# EAGLE design videoselector_2.1v (EAGLE 7.3.0)
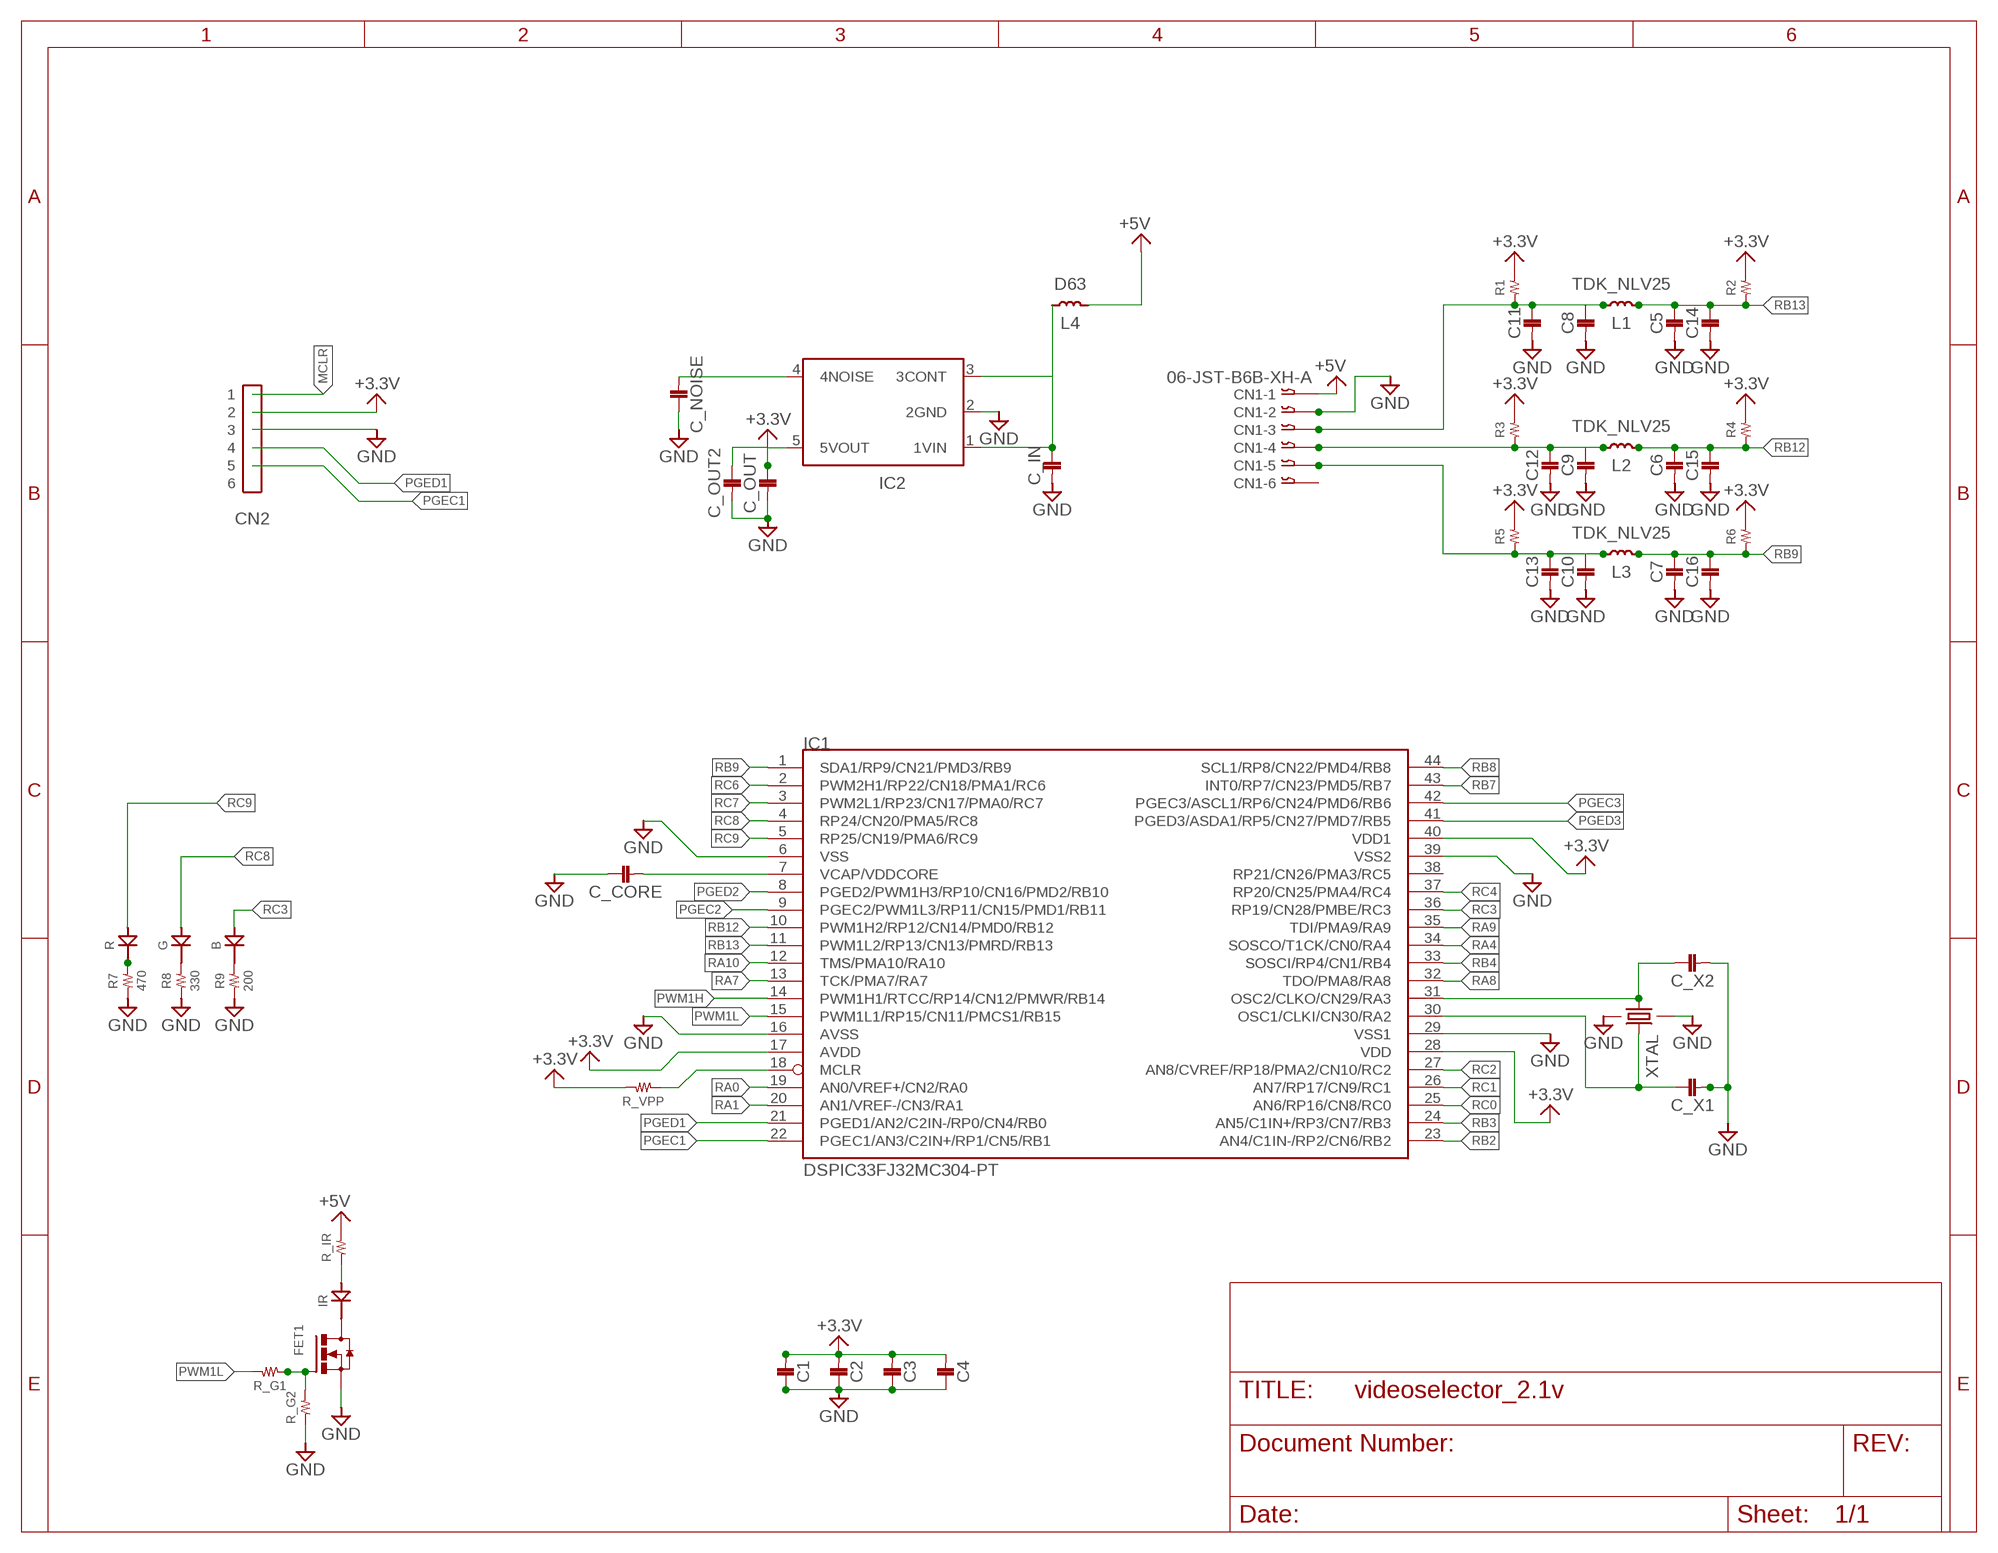
[diagram p0: schematic, sheet 1]

## Parts
B  CHIPLED  [1608]
C1  1608  [1608]
C2  1608  [1608]
C3  1608  [1608]
C4  1608  [1608]
C5  1608  [1608]
C6  1608  [1608]
C7  1608  [1608]
C8  1608  [1608]
C9  1608  [1608]
C10  1608  [1608]
C11  3225  [3225]
C12  3225  [3225]
C13  3225  [3225]
C14  3225  [3225]
C15  3225  [3225]
C16  3225  [3225]
C_CORE  2012  [2012]
C_IN  1608  [1608]
C_NOISE  1608  [1608]
C_OUT  1608  [1608]
C_OUT2  2012  [2012]
C_X1  1608  [1608]
C_X2  1608  [1608]
CN1  06-JST-B6B-XH-A  [B6B-XH]
CN2  PIN_HEADER_6  [PIN_HEADER_6]
FET1  ＩＲＬＭＬ６３４４  [SOT23]
G  CHIPLED  [1608]
IC1  DSPIC33FJ32MC304-PT  [TQFP44]
IC2  TAR5SB  [SSOP5-P-0.95]
IR  5MMLED  [5MM]
L1  TDK_NLV25  [TDK_NLV]
L2  TDK_NLV25  [TDK_NLV]
L3  TDK_NLV25  [TDK_NLV]
L4  D63  [TOKO]
R  CHIPLED  [1608]
R1  RESISTOR__SMD  [1608]
R2  RESISTOR__SMD  [1608]
R3  RESISTOR__SMD  [1608]
R4  RESISTOR__SMD  [1608]
R5  RESISTOR__SMD  [1608]
R6  RESISTOR__SMD  [1608]
R7  470  RESISTOR__SMD  [1608]
R8  330  RESISTOR__SMD  [1608]
R9  200  RESISTOR__SMD  [1608]
R_G1  RESISTOR__SMD  [1608]
R_G2  RESISTOR__SMD  [1608]
R_IR  RESISTOR__SMD  [1608]
R_VPP  RESISTOR__SMD  [1608]
XTAL  FA-238  [FA-238]

## Nets
+3.3V [3.3V]: C1.P$2 C2.P$2 C3.P$2 C4.P$2 C_OUT2.1 C_OUT.P$1 CN2.2 IC1.17(AVDD) IC1.28(VDD) IC1.40(VDD1) IC2.5(5VOUT) R1.2 R2.2 R3.2 R4.2 R5.2 R6.2 R_VPP.2
+5V: CN1.P$1 L4.2 R_IR.2
GND: C1.P$1 C2.P$1 C3.P$1 C4.P$1 C5.P$2 C6.P$2 C7.P$2 C8.P$2 C9.P$2 C10.P$2 C11.P$2 C12.P$2 C13.P$2 C14.P$2 C15.P$2 C16.P$2 C_CORE.1 C_IN.P$2 C_NOISE.P$1 C_OUT2.2 C_OUT.P$2 C_X1.P$2 C_X2.P$2 CN1.P$2 CN2.3 FET1.2(S) IC1.6(VSS) IC1.16(AVSS) IC1.29(VSS1) IC1.39(VSS2) IC2.2(2GND) R7.1 R8.1 R9.1 R_G2.1 XTAL.2 XTAL.4
IC2: C_NOISE.P$2 IC2.4(4NOISE)
MCLR: CN2.1 IC1.18(MCLR) R_VPP.1
N$1: FET1.3(D) IR.K
N$2: R7.2 R.2(K)
N$3: G.2(K) R8.2
N$4: B.2(K) R9.2
N$5: IR.A R_IR.1
N$7: C8.P$1 C11.P$1 CN1.P$3 L1.P$1 R1.1
N$8: C9.P$1 C12.P$1 CN1.P$4 L2.P$1 R3.1
N$9: C_X2.P$1 IC1.31(OSC2/CLKO/CN29/RA3) XTAL.1
N$10: FET1.1(G) R_G1.1 R_G2.2
N$11: C_X1.P$1 IC1.30(OSC1/CLKI/CN30/RA2) XTAL.3
N$13: C10.P$1 C13.P$1 CN1.P$5 L3.P$1 R5.1
N$16: C_IN.P$1 IC2.1(1VIN) IC2.3(3CONT) L4.1
PGEC1: CN2.5 IC1.22(PGEC1/AN3/C2IN+/RP1/CN5/RB1)
PGEC2: IC1.9(PGEC2/PWM1L3/RP11/CN15/PMD1/RB11)
PGEC3: IC1.42(PGEC3/ASCL1/RP6/CN24/PMD6/RB6)
PGED1: CN2.4 IC1.21(PGED1/AN2/C2IN-/RP0/CN4/RB0)
PGED2: IC1.8(PGED2/PWM1H3/RP10/CN16/PMD2/RB10)
PGED3: IC1.41(PGED3/ASDA1/RP5/CN27/PMD7/RB5)
PWM1H: IC1.14(PWM1H1/RTCC/RP14/CN12/PMWR/RB14)
PWM1L: IC1.15(PWM1L1/RP15/CN11/PMCS1/RB15) R_G1.2
RA0: IC1.19(AN0/VREF+/CN2/RA0)
RA1: IC1.20(AN1/VREF-/CN3/RA1)
RA4: IC1.34(SOSCO/T1CK/CN0/RA4)
RA7: IC1.13(TCK/PMA7/RA7)
RA8: IC1.32(TDO/PMA8/RA8)
RA9: IC1.35(TDI/PMA9/RA9)
RA10: IC1.12(TMS/PMA10/RA10)
RB2: IC1.23(AN4/C1IN-/RP2/CN6/RB2)
RB3: IC1.24(AN5/C1IN+/RP3/CN7/RB3)
RB4: IC1.33(SOSCI/RP4/CN1/RB4)
RB7: IC1.43(INT0/RP7/CN23/PMD5/RB7)
RB8: IC1.44(SCL1/RP8/CN22/PMD4/RB8)
RB9: C7.P$1 C16.P$1 IC1.1(SDA1/RP9/CN21/PMD3/RB9) L3.P$2 R6.1
RB12: C6.P$1 C15.P$1 IC1.10(PWM1H2/RP12/CN14/PMD0/RB12) L2.P$2 R4.1
RB13: C5.P$1 C14.P$1 IC1.11(PWM1L2/RP13/CN13/PMRD/RB13) L1.P$2 R2.1
RC0: IC1.25(AN6/RP16/CN8/RC0)
RC1: IC1.26(AN7/RP17/CN9/RC1)
RC2: IC1.27(AN8/CVREF/RP18/PMA2/CN10/RC2)
RC3: B.1(A) IC1.36(RP19/CN28/PMBE/RC3)
RC4: IC1.37(RP20/CN25/PMA4/RC4)
RC6: IC1.2(PWM2H1/RP22/CN18/PMA1/RC6)
RC7: IC1.3(PWM2L1/RP23/CN17/PMA0/RC7)
RC8: G.1(A) IC1.4(RP24/CN20/PMA5/RC8)
RC9: IC1.5(RP25/CN19/PMA6/RC9) R.1(A)
VCAP/VDDCORE: C_CORE.2 IC1.7(VCAP/VDDCORE)
Unconnected: CN1.P$6 CN2.6 IC1.38(RP21/CN26/PMA3/RC5)

## Library data of the parts
B G R = 10_LED:CHIPLED
C1-C10 C_IN C_NOISE C_OUT C_X1 C_X2 = 02_C:1608
C11-C16 = 02_C:3225
C_CORE C_OUT2 = 02_C:2012
CN1 = con-jst-xh:06-JST: JST CONNECTOR
CN2 = 08_CONECTOR:PIN_HEADER_6
FET1 = 06_FET:ＩＲＬＭＬ６３４４
IC1 = microchip-dspic33fjxxmc (1):DSPIC33FJ32MC304: dsPIC33FJ32MC302/304, dsPIC33FJ64MCX02/X04, AND dsPIC33FJ128MCX02/X04 High-Performance, 16-bit Digital Signal Controllers Operating Range: * Up to 40 MIPS operation (at 3.0V -3.6V): - Industrial temperature range (-40°C to +85°C) - Extended temperature range (-40°C to +125°C) High-Performance DSC CPU: * Modified Harvard architecture * C compiler optimized instruction set * 16-bit wide data path * 24-bit wide instructions * Linear program memory addressing up to 4M instruction words * Linear data memory addressing up to 64 Kbytes * 83 base instructions: mostly 1 word/1 cycle * Two 40-bit accumulators with rounding and saturation options * Flexible and powerful addressing modes: - Indirect - Modulo - Bit-Reversed * Software stack * 16 x 16 fractional/integer multiply operations * 32/16 and 16/16 divide operations * Single-cycle multiply and accumulate: - Accumulator write back for DSP operations - Dual data fetch * Up to ±16-bit shifts for up to 40-bit data Direct Memory Access (DMA): * 8-channel hardware DMA * Up to 2 Kbytes dual ported DMA buffer area (DMA RAM) to store data transferred via DMA: - Allows data transfer between RAM and a peripheral while CPU is executing code (no cycle stealing) * Most peripherals support DMA Timers/Capture/Compare/PWM: * Timer/Counters, up to five 16-bit timers: - Can pair up to make two 32-bit timers - One timer runs as a Real-Time Clock with an external 32.768 kHz oscillator - Programmable prescaler * Input Capture (up to four channels): - Capture on up, down or both edges - 16-bit capture input functions - 4-deep FIFO on each capture * Output Compare (up to four channels): - Single or Dual 16-bit Compare mode - 16-bit Glitchless PWM mode * Hardware Real-Time Clock/Calendar (RTCC): - Provides clock, calendar, and alarm functions Interrupt Controller: * 5-cycle latency * Up to 53 available interrupt sources * Up to three external interrupts * Seven programmable priority levels * Five processor exceptions Digital I/O: * Peripheral pin Select functionality * Up to 35 programmable digital I/O pins * Wake-up/Interrupt-on-Change for up to 31 pins * Output pins can drive from 3.0V to 3.6V * Up to 5V output with open drain configuration * All digital input pins are 5V tolerant * 4 mA sink on all I/O pins On-Chip Flash and SRAM: * Flash program memory (up to 128 Kbytes) * Data SRAM (up to 16 Kbytes) * Boot, Secure, and General Security for program Flash System Management: * Flexible clock options: - External, crystal, resonator, internal RC - Fully integrated Phase-Locked Loop (PLL) - Extremely low jitter PLL * Power-up Timer * Oscillator Start-up Timer/Stabilizer * Watchdog Timer with its own RC oscillator * Fail-Safe Clock Monitor * Reset by multiple sources Power Management: * On-chip 2.5V voltage regulator * Switch between clock sources in real time * Idle, Sleep, and Doze modes with fast wake-up Analog-to-Digital Converters (ADCs): * 10-bit, 1.1 Msps or 12-bit, 500 Ksps conversion: - Two and four simultaneous samples (10-bit ADC) - Up to nine input channels with auto-scanning - Conversion start can be manual or synchronized with one of four trigger sources - Conversion possible in Sleep mode - ±2 LSb max integral nonlinearity - ±1 LSb max differential nonlinearity Audio Digital-to-Analog Converter (DAC): - 16-bit Dual Channel DAC module - 100 Ksps maximum sampling rate - Second-Order Digital Delta-Sigma Modulator Comparator Module: * Two analog comparators with programmable input/output configuration CMOS Flash Technology: * Low-power, high-speed Flash technology * Fully static design * 3.3V (±10%) operating voltage * Industrial and Extended temperature * Low power consumption Motor Control Peripherals: * 6-channel 16-bit Motor Control PWM: - Three duty cycle generators - Independent or Complementary mode - Programmable dead-time and output polarity - Edge-aligned or center-aligned - Manual output override control - One Fault input - Trigger for ADC conversions - PWM frequency for 16-bit resolution (@ 40 MIPS) = 1220 Hz for Edge-Aligned mode, 610 Hz for Center-Aligned mode - PWM frequency for 11-bit resolution (@ 40 MIPS) = 39.1 kHz for Edge-Aligned mode, 19.55 kHz for Center-Aligned mode * 2-channel 16-bit Motor Control PWM: - One duty cycle generator - Independent or Complementary mode - Programmable dead time and output polarity - Edge-aligned or center-aligned - Manual output override control - One Fault input - Trigger for ADC conversions - PWM frequency for 16-bit resolution (@ 40 MIPS) = 1220 Hz for Edge-Aligned mode, 610 Hz for Center-Aligned mode - PWM frequency for 11-bit resolution (@ 40 MIPS) = 39.1 kHz for Edge-Aligned mode, 19.55 kHz for Center-Aligned mode * 2-Quadrature Encoder Interface module: - Phase A, Phase B, and index pulse input - 16-bit up/down position counter - Count direction status - Position Measurement (x2 and x4) mode - Programmable digital noise filters on inputs - Alternate 16-bit Timer/Counter mode - Interrupt on position counter rollover/underflow
IC2 = 04_IC:TAR5SB
IR = 10_LED:5MMLED
L1-L3 = 03_L:TDK_NLV25
L4 = 03_L:D63
R1-R9 R_G1 R_G2 R_IR R_VPP = 01_R:RESISTOR__SMD
XTAL = 09_2_CRYSTAL:FA-238

## Net classes
1 3.3V: clearance 0.25 mm

## Board
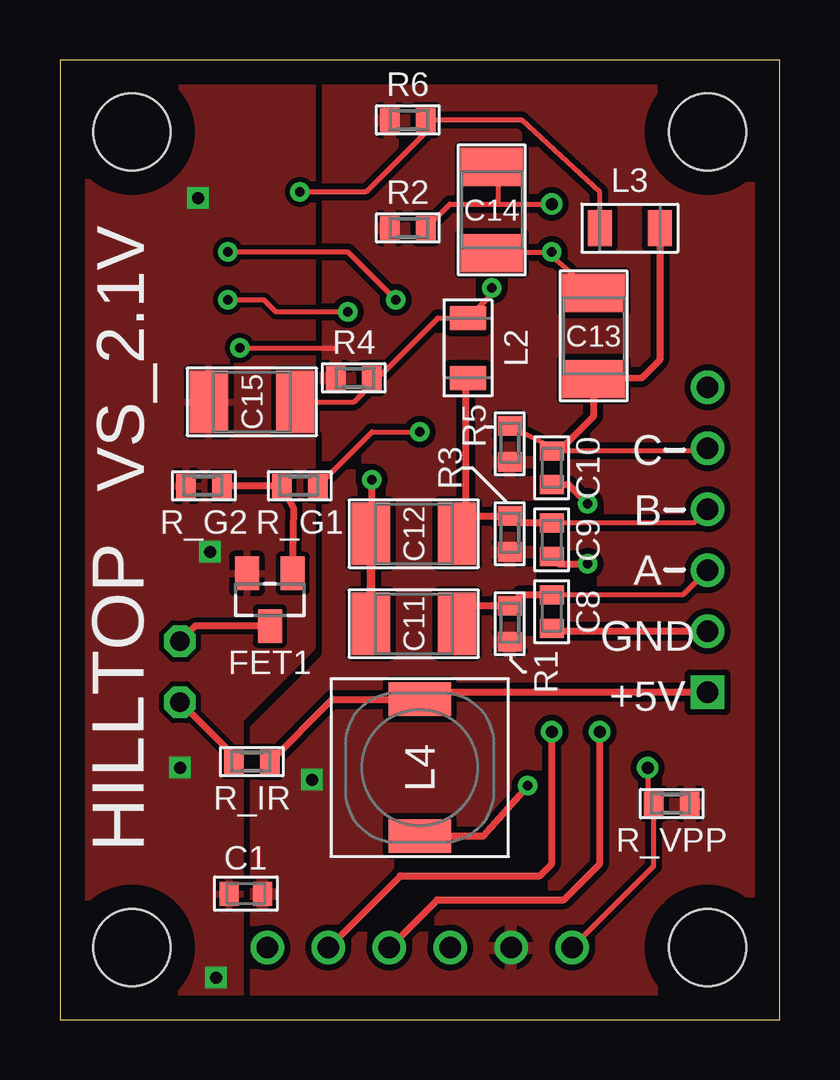
[diagram p1: board, top side]
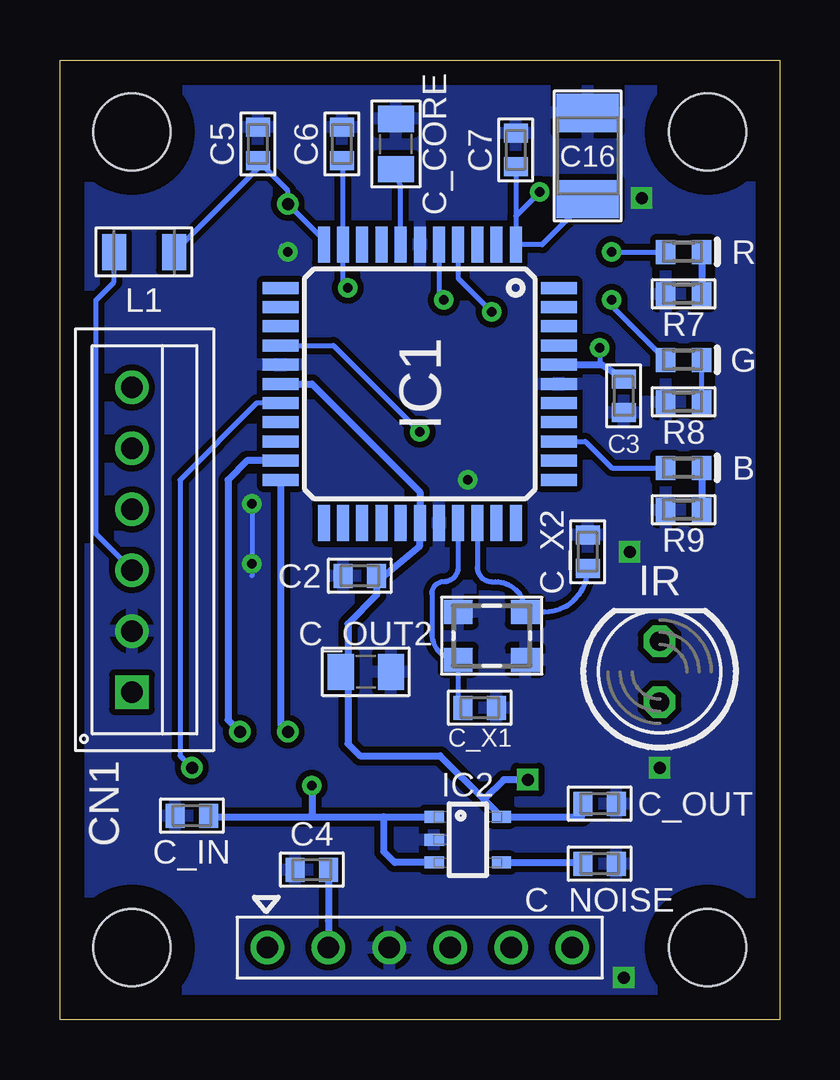
[diagram p2: board, bottom side, seen from below]

Size 30 x 40 mm. Coordinates in mm from the lower left corner, seen from the top.
Outline: 0,0 30,0 30,40 0,40 0,0
Copper layers (1*16): Top 0.035mm / dielectric 1.5mm / Bottom 0.035mm
Design rules "default *": minimum track width 0.2mm, minimum drill 0.4mm, track to track 8mil, track to pad 8mil, pad to pad 8mil, via to via 8mil, smd to smd 8mil, copper to edge 40mil, drill to drill 8mil, minimum pad ring 10mil, minimum via ring 8mil, stop-mask expansion 4mil, vias tented up to drill 4mm, thermal gap 10mil
Holes 3.2 mm at 3,3 3,37 27,37 27,3

### Footprints (pad centres in the part's own frame; a part is rotated, then mirrored left to right if it is on the bottom)
1608 = smd 0.8 x 1: 1 -0.75,0; 2 0.75,0
1608' = smd 0.8 x 1: P$1 -0.7,0; P$2 0.7,0
3225 = smd 1.6 x 2.6: P$1 -1.8,0; P$2 1.8,0
2012 = smd 1.1 x 1.5: 1 -1.05,0; 2 1.05,0
B6B-XH = drill 0.9 square: P$1 6.35,0 | drill 0.9: P$2 3.81,0; P$3 1.27,0; P$4 -1.27,0; P$5 -3.81,0; P$6 -6.35,0
PIN_HEADER_6 = drill 0.9: 1 -6.35,0; 2 -3.81,0; 3 -1.27,0; 4 1.27,0; 5 3.81,0; 6 6.35,0
SOT23 = smd 1 x 1.4: 1 -0.95,-1.1; 2 0.95,-1.1; 3 0,1.1
TQFP44 = smd 1.5 x 0.5: 1 -5.8,4; 2 -5.8,3.2; 3 -5.8,2.4; 4 -5.8,1.6; 5 -5.8,0.8; 6 -5.8,0; 7 -5.8,-0.8; 8 -5.8,-1.6; 9 -5.8,-2.4; 10 -5.8,-3.2; 11 -5.8,-4; 23 5.8,-4; 24 5.8,-3.2; 25 5.8,-2.4; 26 5.8,-1.6; 27 5.8,-0.8; 28 5.8,0; 29 5.8,0.8; 30 5.8,1.6; 31 5.8,2.4; 32 5.8,3.2; 33 5.8,4 | smd 0.5 x 1.5: 12 -4,-5.8; 13 -3.2,-5.8; 14 -2.4,-5.8; 15 -1.6,-5.8; 16 -0.8,-5.8; 17 0,-5.8; 18 0.8,-5.8; 19 1.6,-5.8; 20 2.4,-5.8; 21 3.2,-5.8; 22 4,-5.8; 34 4,5.8; 35 3.2,5.8; 36 2.4,5.8; 37 1.6,5.8; 38 0.8,5.8; 39 0,5.8; 40 -0.8,5.8; 41 -1.6,5.8; 42 -2.4,5.8; 43 -3.2,5.8; 44 -4,5.8
SSOP5-P-0.95 = smd 0.5 x 0.8: 1 -0.95,-1.4; 2 0,-1.4; 3 0.95,-1.4; 4 0.95,1.4; 5 -0.95,1.4
5MM = drill 0.813 octagon: A 0,-1.27; K 0,1.27
TDK_NLV = smd 1 x 1.5: P$1 1.25,0; P$2 -1.25,0
TOKO = smd 1.4 x 2.6: 1 -2.85,0; 2 2.85,0
FA-238 = smd 1.2 x 1: 1 -1.4,-1; 2 1.4,-1; 3 1.4,1; 4 -1.4,1

### Placement (x,y rotation side)
B  4,23 0 bottom
C1  [1608']  7.75,5.25 0 top
C2  [1608']  17.5,18.5 0 bottom
C3  [1608']  6.5,26 90 bottom
C4  [1608']  19.5,6.25 0 bottom
C5  [1608']  21.75,36.5 90 bottom
C6  [1608']  18.25,36.5 90 bottom
C7  [1608']  11,36.25 90 bottom
C8  [1608']  20.5,17 270 top
C9  [1608']  20.5,20 270 top
C10  [1608']  20.5,23 270 top
C11  14.75,16.5 180 top
C12  14.75,20.25 180 top
C13  22.25,28.5 90 top
C14  18,33.75 270 top
C15  8,25.75 180 top
C16  8,36 90 bottom
C_CORE  16,36.5 270 bottom
C_IN  [1608']  24.5,8.5 180 bottom
C_NOISE  [1608']  7.5,6.5 180 bottom
C_OUT  [1608']  7.5,9 0 bottom
C_OUT2  17.25,14.5 0 bottom
C_X1  [1608']  12.5,13 0 bottom
C_X2  [1608']  8,19.5 90 bottom
CN1  27,20 270 bottom
CN2  15,3 0 bottom
DRILEGEND  [DRILEGEND]  -7.15,-14.96 0 top  (outside the outline)
FET1  8.75,17.5 180 top
G  4,27.5 0 bottom
IC1  15,26.5 270 bottom
IC2  13,7.5 270 bottom
IR  5,14.5 0 bottom
L1  26.5,32 180 bottom
L2  17,28 270 top
L3  23.75,33 0 top
L4  15,10.5 90 top
R  4,32 0 bottom
R1  18.75,16.5 270 top
R2  14.5,33 180 top
R3  18.75,20.25 270 top
R4  12.25,26.75 180 top
R5  18.75,24 270 top
R6  14.5,37.5 180 top
R7  4,30.25 0 bottom
R8  4,25.75 0 bottom
R9  4,21.25 0 bottom
R_G1  10,22.25 0 top
R_G2  6,22.25 0 top
R_IR  8,10.75 0 top
R_VPP  25.5,9 0 top
XTAL  12,16 180 bottom

### Tracks (layer width: path | path; a pad name or v marks a point on that pad's centre or on a via)
+3.3V  (via drill 0.4, 0.5)
  Top 0.2: v7.5,28 11.5,28
  Bottom 0.2: IC1.40 8.2,27.3 | v7.5,28 7.5,27.4 7.4,27.3
  Bottom 0.3: C4.P$2 18.81,4.11 CN2.2 | C_OUT.P$1 8.25,8.45 IC2.5 12.32,9.18 | IC1.40 7.4,27.3 C3.P$2 | 18,14.55 18,16.5 16.8,17.7 C2.P$2 16.5,18.5 15,19.75 IC1.28 15,22 19.5,26.5 IC1.17 | 18,14.55 C_OUT2.1 | 18,14.55 18,11.5 17.5,11 14.15,11 12.32,9.18 | v10.5,10 11.5,10 12.32,9.18
  pour Top (isolate 0.1, rank 3): 0,40 30,40 30,0 0,0
+5V
  Top 0.3: R_IR.2 11.35,13.35 L4.2 16.3,13.65 CN1.P$1
GND  (via drill 0.4, 0.5)
  Top 0.2: 26.89,16.3 CN1.P$2 | C13.P$2 20.5,31.8 v20.5,32 18.05,32 C14.P$2
  Top 0.3: C12.P$2 C11.P$2 13,16.55 v13,22.5 | C8.P$2 20.61,16.19 CN1.P$2 | C9.P$2 20.8,19 v22,19 | C10.P$2 21.2,22.3 v22,21.5
  Bottom 0.2: 22,18.5 v22,19 v22,21.5 | v20.5,32 20.75,32.25
  other vias: 5,10.5 6.25,19.5 6.5,1.75 5.75,34.25
  pour Bottom (isolate 0.254): 0,40 30,40 30,0 0,0
  pour Top (isolate 0.2): 0,40 10.5,40 10.5,15.5 7.5,12.5 7.5,0 0,0
IC2
  Bottom 0.3: IC2.4 8.25,6.55 C_NOISE.P$2
MCLR  (via drill 0.5)
  Top 0.2: CN2.1 24.75,6.4 R_VPP.1 24.5,9.25 v24.5,10.5
  Bottom 0.2: IC1.18 21.8,25.7 25,22.5 25,11 v24.5,10.5
N$1
  Top 0.3: FET1.3 5.63,16.4 IR.K
N$2
  Bottom 0.3: R.2 R7.2
N$3
  Bottom 0.2: R8.2 G.2
N$4
  Bottom 0.3: B.2 R9.2
N$5
  Top 0.3: R_IR.1 7.25,10.98 IR.A
N$7
  Top 0.2: CN1.P$3 25.97,17.7 C8.P$1
  Top 0.3: C8.P$1 19.2,17.7 R1.1 17.3,17.25 C11.P$1
  Bottom 0.2: CN1.P$3 28.5,20.23 28.5,30 27.75,30.75 L1.P$1
N$8
  Top 0.2: CN1.P$4 26.43,20.7 C9.P$1
  Top 0.3: C9.P$1 19.05,20.7 R3.1 17.3,21 16.9,20.6 | C12.P$1 16.9,20.6 | L2.P$1 16.9,26.65 16.9,20.6
N$9
  Bottom 0.2: IC1.31 12.6,18.85 arc-90 12,18.25 11.85,18.25 arc90 XTAL.1 9.8,17 arc-90 C_X2.P$1
N$10
  Top 0.3: FET1.1 9.75,21.3 R_G1.1 R_G2.2
N$11
  Bottom 0.2: C_X1.P$1 13.4,13.2 XTAL.3 arc90 14.5,16.1 14.5,17.75 arc90 14,18.25 arc-90 13.4,18.85 IC1.30
N$13
  Top 0.2: R5.1 20.8,23.7 | CN1.P$5 26.89,23.7 20.8,23.7 | 20.8,23.7 C10.P$1
  Top 0.3: L3.P$1 25,27.5 24.25,26.75 C13.P$1 22.25,25.15 20.8,23.7
N$16  (via drill 0.4)
  Top 0.3: L4.1 17.65,7.65 v19.5,9.75
  Bottom 0.3: C_IN.P$1 23.75,8.45 19.5,8.45 | 19.5,8.45 16.5,8.45 | 16.5,8.45 IC2.1 | IC2.3 16.05,6.55 16.5,7 16.5,8.45 | v19.5,9.75 19.5,8.45
PGEC1  (via drill 0.5)
  Top 0.3: CN2.5 14.19,6 20,6 20.5,6.5 v20.5,12
  Bottom 0.3: IC1.22 20.8,12.3 v20.5,12
PGED1  (via drill 0.5)
  Top 0.3: 22.5,11.77 v22.5,12 22.5,6.5 21,5 15.73,5 CN2.4
  Bottom 0.3: IC1.21 22.2,23.3 23,22.5 23,12.5 v22.5,12
PWM1L  (via drill 0.4)
  Top 0.2: R_G1.2 13,24.5 v15,24.5
  Bottom 0.2: IC1.15 18.6,28.1 v15,24.5
RB9  (via drill 0.4)
  Top 0.2: L3.P$2 22.5,34.5 19.25,37.5 R6.1 15.25,37 12.75,34.5 v10,34.5
  Bottom 0.2: v10,34.5 11,33.5 IC1.1 | C16.P$1 9.9,32.3 IC1.1 | C7.P$1 IC1.1
RB12  (via drill 0.4)
  Top 0.2: v18,30.5 18,30.25 L2.P$2 15.75,29.25 13.25,26.75 R4.1 13,26.5 12.25,25.75 C15.P$1
  Bottom 0.2: C6.P$1 18.2,35.6 IC1.10 18.2,30.7 v18,30.5
RB13  (via drill 0.5)
  Top 0.2: R2.1 16.25,34 18.25,34 | 18.25,34 v20.5,34 | C14.P$1 18.25,35.3 18.25,34
  Bottom 0.2: IC1.11 19,32.5 v20.5,34 20.5,34.55 C5.P$1 21.75,35.5 L1.P$2
RC3
  Bottom 0.2: IC1.36 8.1,24.1 7,23 B.1
RC8  (via drill 0.4)
  Top 0.2: v12,29.5 9,29.5 8.5,30 v7,30
  Bottom 0.2: IC1.4 13.4,30.9 v12,29.5 | v7,30 7,29.75 G.1
RC9  (via drill 0.4)
  Top 0.2: v14,30 12,32 v7,32
  Bottom 0.2: IC1.5 14.2,30.2 v14,30 | v7,32 R.1
VCAP/VDDCORE
  Bottom 0.2: IC1.7 15.8,34.75 C_CORE.2

### Text on the board
tPlace: VS_2.1V | HILLTOP
tNames: C | B | A | GND | +5V
Measures: 穴図